# EAGLE design main-board (EAGLE 7.7.0)
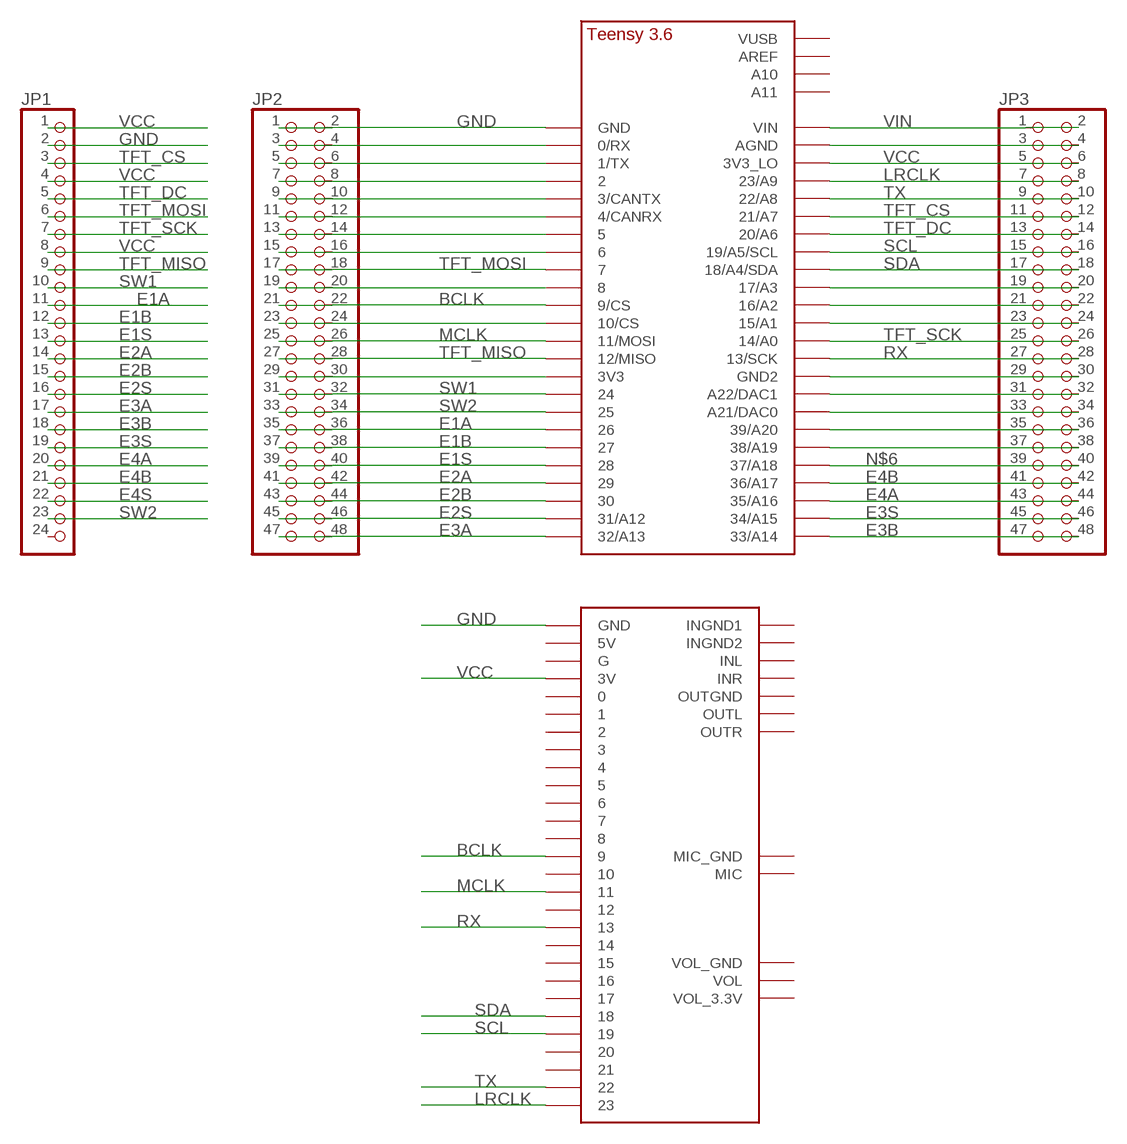
[diagram p0: schematic, sheet 1]

## Parts
JP1  PINHD-1X24  [1X24]
JP2  PINHD-2X24  [2X24]
JP3  PINHD-2X24  [2X24]
U$1  TEENSY_3.5/3.6_BASIC  [TEENSY_3.5/3.6_BASIC]
U$2  AUDIOSHIELD  [AUDIOSHIELD]

## Nets
BCLK: JP2.21 JP2.22 U$1.9/CS U$2.9
E1A: JP1.11 JP2.35 JP2.36 U$1.26
E1B: JP1.12 JP2.37 JP2.38 U$1.27
E1S: JP1.13 JP2.39 JP2.40 U$1.28
E2A: JP1.14 JP2.41 JP2.42 U$1.29
E2B: JP1.15 JP2.43 JP2.44 U$1.30
E2S: JP1.16 JP2.45 JP2.46 U$1.31/A12
E3A: JP1.17 JP2.47 JP2.48 U$1.32/A13
E3B: JP1.18 JP3.47 JP3.48 U$1.33/A14
E3S: JP1.19 JP3.45 JP3.46 U$1.34/A15
E4A: JP1.20 JP3.43 JP3.44 U$1.35/A16
E4B: JP1.21 JP3.41 JP3.42 U$1.36/A17
E4S: JP1.22
GND: JP1.2 JP2.1 JP2.2 U$1.GND U$2.GND
LRCLK: JP3.7 JP3.8 U$1.23/A9 U$2.23
MCLK: JP2.25 JP2.26 U$1.11/MOSI U$2.11
N$3: JP2.3 JP2.4 U$1.0/RX
N$4: JP2.5 JP2.6 U$1.1/TX
N$5: JP2.7 JP2.8 U$1.2
N$6: JP3.39 JP3.40 U$1.37/A18
N$7: JP2.9 JP2.10 U$1.3/CANTX
N$8: JP2.11 JP2.12 U$1.4/CANRX
N$9: JP2.13 JP2.14 U$1.5
N$10: JP2.15 JP2.16 U$1.6
N$11: JP2.19 JP2.20 U$1.8
N$12: JP2.23 JP2.24 U$1.10/CS
N$13: JP2.29 JP2.30 U$1.3V3
N$15: JP3.3 JP3.4 U$1.AGND
N$16: JP3.19 JP3.20 U$1.17/A3
N$17: JP3.21 JP3.22 U$1.16/A2
N$18: JP3.23 JP3.24 U$1.15/A1
N$19: JP3.29 JP3.30 U$1.GND2
N$20: JP3.31 JP3.32 U$1.A22/DAC1
N$21: JP3.33 JP3.34 U$1.21/DAC0(A21/DAC0)
N$22: JP3.35 JP3.36 U$1.39/A20
N$23: JP3.37 JP3.38 U$1.38/A19
RX: JP3.27 JP3.28 U$1.13/SCK U$2.13
SCL: JP3.15 JP3.16 U$1.19/A5/SCL U$2.19
SDA: JP3.17 JP3.18 U$1.18/A4/SDA U$2.18
SW1: JP1.10 JP2.31 JP2.32 U$1.24
SW2: JP1.23 JP2.33 JP2.34 U$1.25
TFT_CS: JP1.3 JP3.11 JP3.12 U$1.21/A7
TFT_DC: JP1.5 JP3.13 JP3.14 U$1.20/A6
TFT_MISO: JP1.9 JP2.27 JP2.28 U$1.12/MISO
TFT_MOSI: JP1.6 JP2.17 JP2.18 U$1.7
TFT_SCK: JP1.7 JP3.25 JP3.26 U$1.14/A0
TX: JP3.9 JP3.10 U$1.22/A8 U$2.22
VCC: JP1.1 JP1.4 JP1.8 JP3.5 JP3.6 U$1.3V3_LO U$2.3V
VIN: JP3.1 JP3.2 U$1.VIN
Unconnected: JP1.24 U$1.A10 U$1.A11 U$1.AREF U$1.VUSB U$2.0 U$2.1 U$2.2 U$2.3 U$2.4 U$2.5 U$2.5V U$2.6 U$2.7 U$2.8 U$2.10 U$2.12 U$2.14 U$2.15 U$2.16 U$2.17 U$2.20 U$2.21 U$2.G U$2.GND_MIC(MIC_GND) U$2.INGND1 U$2.INGND2 U$2.INL U$2.INR U$2.MIC U$2.OUTGND U$2.OUTL U$2.OUTR U$2.VOL U$2.VOL_3.3V U$2.VOL_GND

## Library data of the parts
JP1 = pinhead:PINHD-1X24: PIN HEADER
JP2 JP3 = pinhead:PINHD-2X24: PIN HEADER
U$1 = JC_Teensy356:TEENSY_3.5/3.6_BASIC
U$2 = Teensy_Audioshield:AUDIOSHIELD: Teensy 3 Audioshield by PJRC.COM

## Board
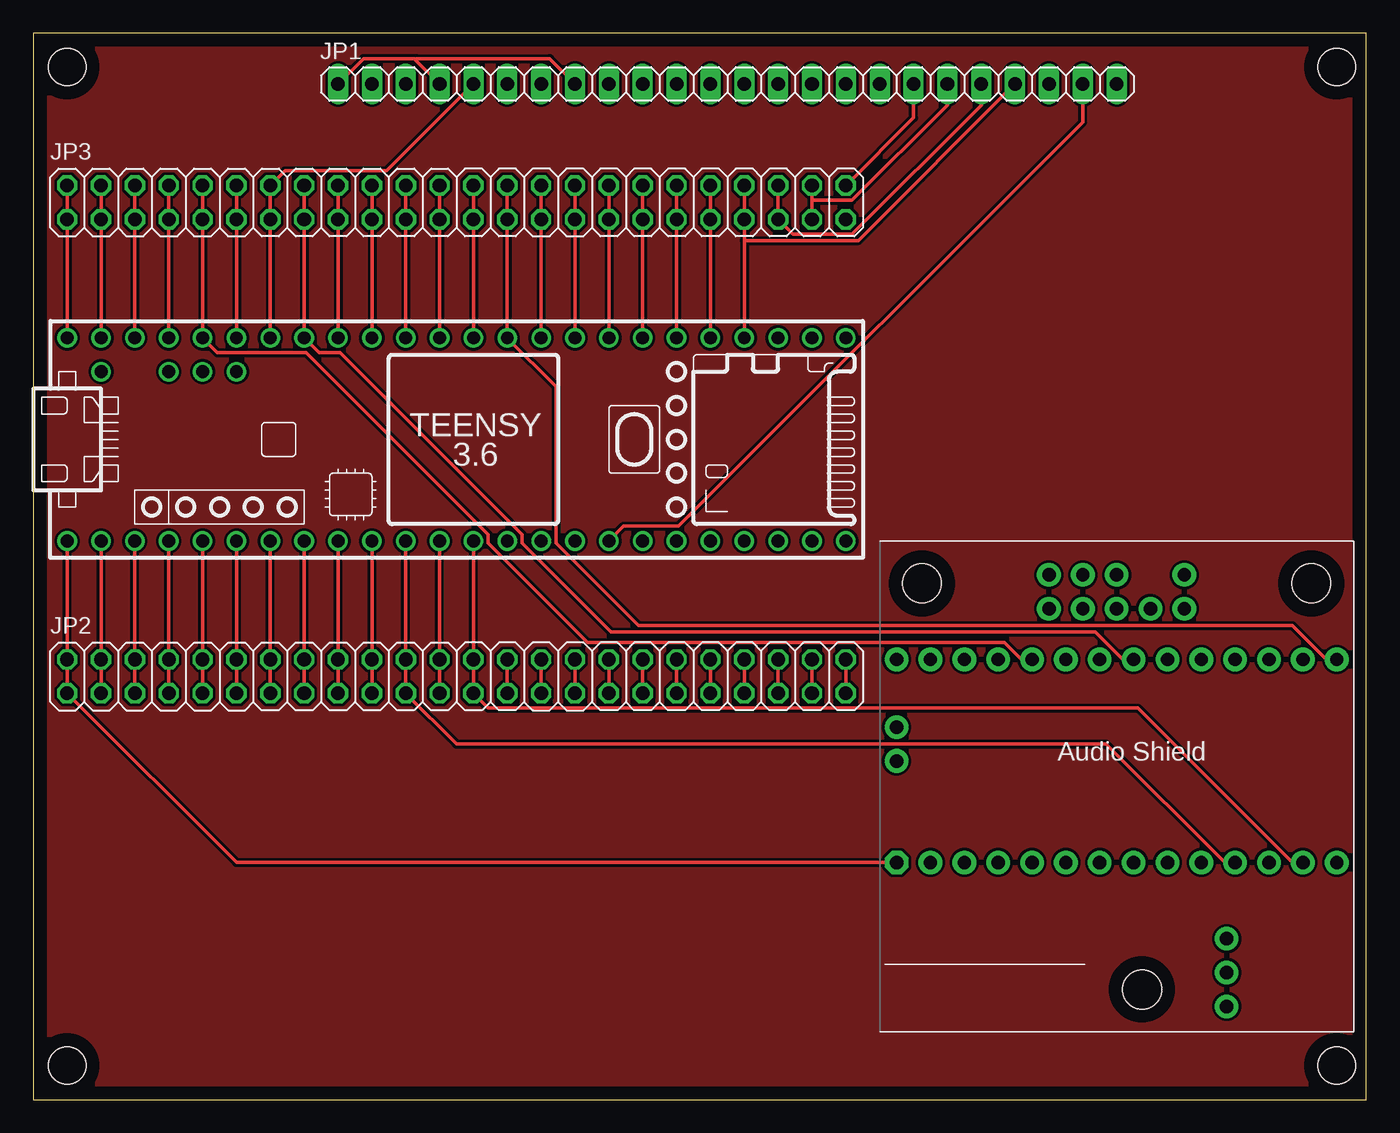
[diagram p1: board, top side]
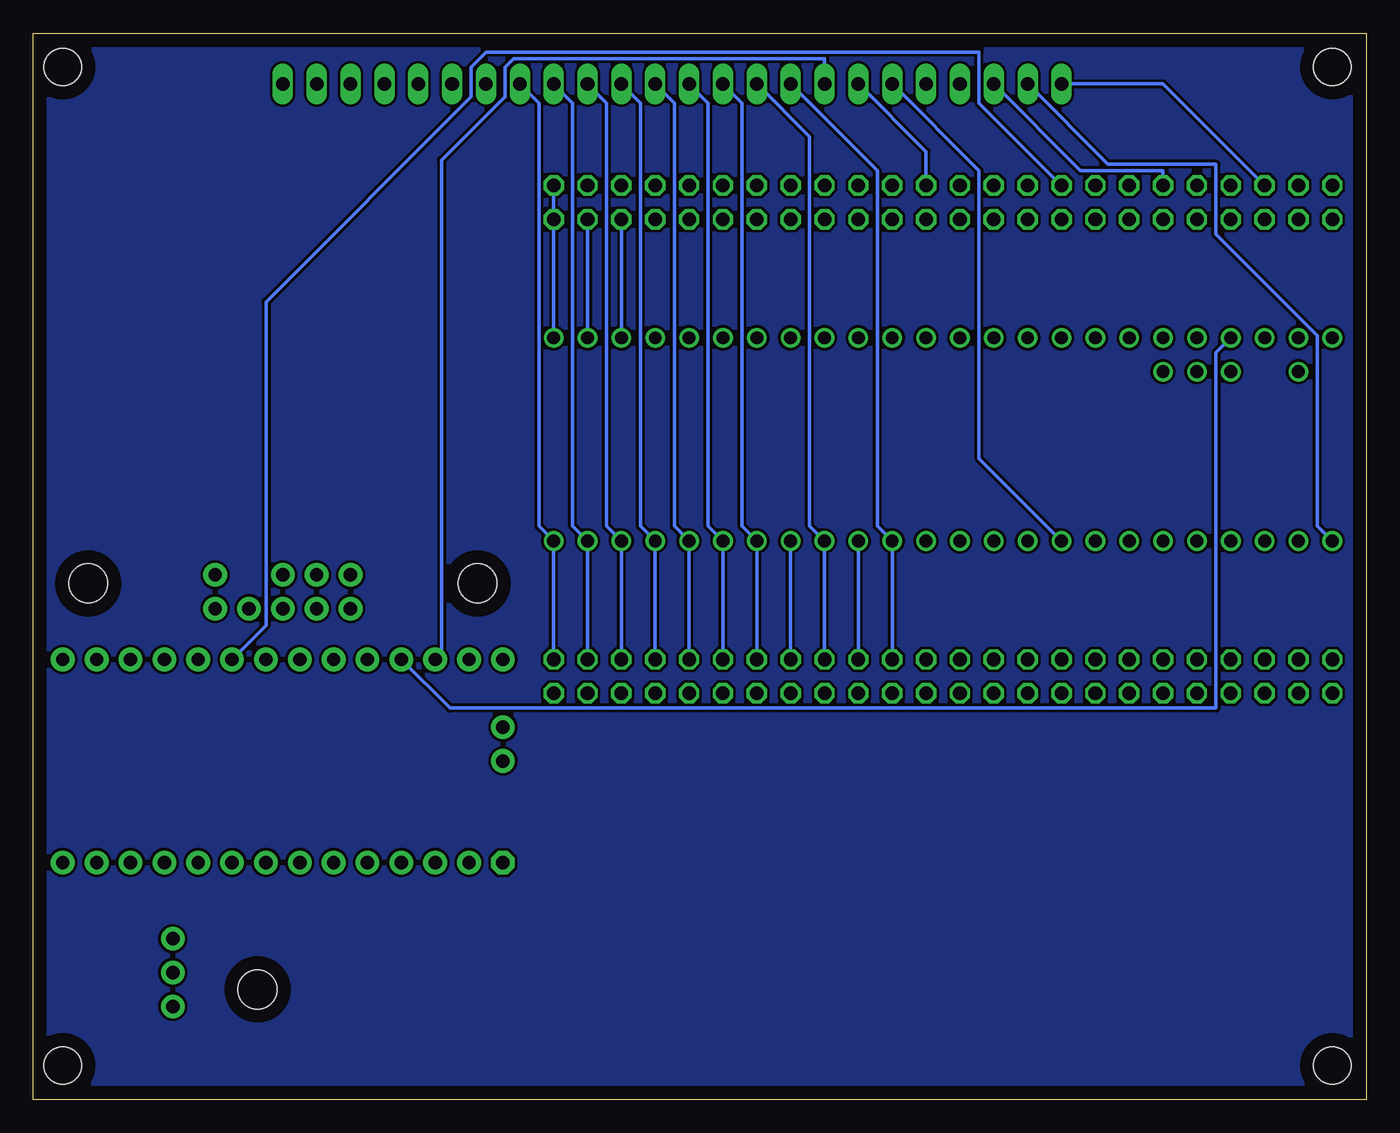
[diagram p2: board, bottom side, seen from below]

Size 100 x 80 mm. Coordinates in mm from the lower left corner, seen from the top.
Outline: 0,0 100,0 100,80 0,80 0,0
Copper layers (1*16): Top 0.035mm / dielectric 1.5mm / Bottom 0.035mm
Design rules "default": minimum track width 10mil, minimum drill 24mil, track to track 8mil, track to pad 8mil, pad to pad 8mil, via to via 8mil, smd to smd 8mil, copper to edge 40mil, drill to drill 8mil, minimum pad ring 10mil, minimum via ring 8mil, stop-mask expansion 4mil, vias tented up to drill 0mil, thermal gap 10mil
Holes 2.8 mm at 2.54,77.47 2.54,2.54 97.79,77.47 97.79,2.54

### Footprints (pad centres in the part's own frame; a part is rotated, then mirrored left to right if it is on the bottom)
1X24 = drill 1.016 long: 1 -29.21,0; 2 -26.67,0; 3 -24.13,0; 4 -21.59,0; 5 -19.05,0; 6 -16.51,0; 7 -13.97,0; 8 -11.43,0; 9 -8.89,0; 10 -6.35,0; 11 -3.81,0; 12 -1.27,0; 13 1.27,0; 14 3.81,0; 15 6.35,0; 16 8.89,0; 17 11.43,0; 18 13.97,0; 19 16.51,0; 20 19.05,0; 21 21.59,0; 22 24.13,0; 23 26.67,0; 24 29.21,0
2X24 = drill 1.016 octagon: 1 -27.94,-1.27; 2 -27.94,1.27; 3 -25.4,-1.27; 4 -25.4,1.27; 5 -22.86,-1.27; 6 -22.86,1.27; 7 -20.32,-1.27; 8 -20.32,1.27; 9 -17.78,-1.27; 10 -17.78,1.27; 11 -15.24,-1.27; 12 -15.24,1.27; 13 -12.7,-1.27; 14 -12.7,1.27; 15 -10.16,-1.27; 16 -10.16,1.27; 17 -7.62,-1.27; 18 -7.62,1.27; 19 -5.08,-1.27; 20 -5.08,1.27; 21 -2.54,-1.27; 22 -2.54,1.27; 23 0,-1.27; 24 0,1.27; 25 2.54,-1.27; 26 2.54,1.27; 27 5.08,-1.27; 28 5.08,1.27; 29 7.62,-1.27; 30 7.62,1.27; 31 10.16,-1.27; 32 10.16,1.27; 33 12.7,-1.27; 34 12.7,1.27; 35 15.24,-1.27; 36 15.24,1.27; 37 17.78,-1.27; 38 17.78,1.27; 39 20.32,-1.27; 40 20.32,1.27; 41 22.86,-1.27; 42 22.86,1.27; 43 25.4,-1.27; 44 25.4,1.27; 45 27.94,-1.27; 46 27.94,1.27; 47 30.48,-1.27; 48 30.48,1.27
TEENSY_3.5/3.6_BASIC = drill 0.965: 0/RX -25.4,-7.62; 1/TX -22.86,-7.62; 2 -20.32,-7.62; 3/CANTX -17.78,-7.62; 3V3 7.62,-7.62; 3V3_LO -22.86,7.62; 4/CANRX -15.24,-7.62; 5 -12.7,-7.62; 6 -10.16,-7.62; 7 -7.62,-7.62; 8 -5.08,-7.62; 9/CS -2.54,-7.62; 10/CS 0,-7.62; 11/MOSI 2.54,-7.62; 12/MISO 5.08,-7.62; 13/SCK 5.08,7.62; 14/A0 2.54,7.62; 15/A1 0,7.62; 16/A2 -2.54,7.62; 17/A3 -5.08,7.62; 18/A4/SDA -7.62,7.62; 19/A5/SCL -10.16,7.62; 20/A6 -12.7,7.62; 21/A7 -15.24,7.62; 21/DAC0 12.7,7.62; 22/A8 -17.78,7.62; 23/A9 -20.32,7.62; 24 10.16,-7.62; 25 12.7,-7.62; 26 15.24,-7.62; 27 17.78,-7.62; 28 20.32,-7.62; 29 22.86,-7.62; 30 25.4,-7.62; 31/A12 27.94,-7.62; 32/A13 30.48,-7.62; 33/A14 30.48,7.62; 34/A15 27.94,7.62; 35/A16 25.4,7.62; 36/A17 22.86,7.62; 37/A18 20.32,7.62; 38/A19 17.78,7.62; 39/A20 15.24,7.62; A10 -17.78,5.08; A11 -15.24,5.08; A22/DAC1 10.16,7.62; AGND -25.4,7.62; AREF -20.32,5.08; GND -27.94,-7.62; GND2 7.62,7.62; VIN -27.94,7.62; VUSB -25.4,5.08
AUDIOSHIELD = drill 1 pad 1.778: 0 -13.97,-5.08; 1 -11.43,-5.08; 2 -8.89,-5.08; 3 -6.35,-5.08; 3V -11.43,10.16; 4 -3.81,-5.08; 5 -1.27,-5.08; 5V -16.51,10.16; 6 1.27,-5.08; 7 3.81,-5.08; 8 6.35,-5.08; 9 8.89,-5.08; 10 11.43,-5.08; 11 13.97,-5.08; 12 16.51,-5.08; 13 16.51,10.16; 14 13.97,10.16; 15 11.43,10.16; 16 8.89,10.16; 17 6.35,10.16; 18 3.81,10.16; 19 1.27,10.16; 20 -1.27,10.16; 21 -3.81,10.16; 22 -6.35,10.16; 23 -8.89,10.16; G -13.97,10.16; GND_MIC -16.51,2.54; INGND1 -5.08,16.51; INGND2 -2.54,16.51; INL -5.08,13.97; INR -2.54,13.97; MIC -16.51,5.08; OUTGND 2.54,13.97; OUTL 5.08,13.97; OUTR 0,13.97; UNUSED1 0,16.51; UNUSED2 5.08,16.51; VOL 8.255,-13.335; VOL_3.3V 8.255,-15.875; VOL_GND 8.255,-10.795 | drill 1 pad 1.778 octagon: GND -16.51,-5.08 | hole 2.921: 1.905,-14.605; -14.605,15.875; 14.605,15.875

### Placement (x,y rotation side)
JP1  52.07,76.2 0 top
JP2  30.48,31.75 0 top
JP3  30.48,67.31 0 top
U$1  30.48,49.53 0 top
U$2  81.28,22.86 0 top

### Tracks (layer width: path | path; a pad name or v marks a point on that pad's centre or on a via)
BCLK
  Top 0.254: U$1.9/CS JP2.22 JP2.21 31.75,26.67 80.49,26.67 89.38,17.78 U$2.9
E1A
  Top 0.254: JP2.36 JP2.35
  Bottom 0.254: JP2.36 U$1.26 46.83,43.02 46.83,74.77 JP1.11
E1B
  Top 0.254: JP2.38 JP2.37
  Bottom 0.254: JP2.38 U$1.27 49.37,43.02 49.37,74.77 JP1.12
E1S
  Top 0.254: JP2.40 JP2.39
  Bottom 0.254: JP2.40 U$1.28 51.91,43.02 51.91,74.77 JP1.13
E2A
  Top 0.254: JP2.42 JP2.41
  Bottom 0.254: JP2.42 U$1.29 54.45,43.02 54.45,74.77 JP1.14
E2B
  Top 0.254: JP2.44 JP2.43
  Bottom 0.254: JP2.44 U$1.30 56.99,43.02 56.99,74.77 JP1.15
E2S
  Top 0.254: JP2.46 JP2.45
  Bottom 0.254: JP2.46 U$1.31/A12 59.53,43.02 59.53,74.77 JP1.16
E3A
  Top 0.254: JP2.48 JP2.47
  Bottom 0.254: JP2.48 U$1.32/A13 62.07,43.02 62.07,74.77 JP1.17
E3B
  Top 0.254: JP1.18 66.04,73.66 JP3.48
  Bottom 0.254: U$1.33/A14 JP3.47 JP3.48
E3S
  Top 0.254: JP3.45 58.42,67.47 | 58.42,67.47 JP3.46 | JP1.19 68.58,74.61 61.44,67.47 58.42,67.47
  Bottom 0.254: JP3.45 U$1.34/A15
E4A
  Top 0.254: JP3.44 JP3.43 56.99,64.93 61.44,64.93 71.12,74.61 JP1.20
  Bottom 0.254: JP3.43 U$1.35/A16
E4B
  Top 0.254: 53.34,64.45 JP3.41 JP3.42 | 53.34,64.45 U$1.36/A17 | JP1.21 61.91,64.45 53.34,64.45
GND
  Top 0.254: U$1.GND JP2.2 JP2.1 15.24,17.78 U$2.GND
  Bottom 0.254: JP1.2 19.37,70.17 11.27,70.17 11.27,64.93 3.65,57.31 3.65,43.02 U$1.GND
LRCLK
  Top 0.254: U$1.23/A9 JP3.7 JP3.8
  Bottom 0.254: U$2.23 68.74,29.37 11.27,29.37 11.27,56.04 U$1.23/A9
MCLK
  Top 0.254: U$1.11/MOSI JP2.26 JP2.25 34.13,29.37 82.87,29.37 94.46,17.78 U$2.11
N$1
  pour Top: 0,0 0,77.47 0,78.74 1.27,80.01 99.06,80.01 100.33,78.74 100.33,2.54 97.79,0
N$2
  pour Bottom: 0,76.2 0,77.47 2.54,80.01 97.79,80.01 100.33,77.47 100.33,1.27 99.06,0 2.54,0 0,2.54
N$3
  Top 0.254: U$1.0/RX JP2.4 JP2.3
N$4
  Top 0.254: U$1.1/TX JP2.6 JP2.5
N$5
  Top 0.254: U$1.2 JP2.8 JP2.7
N$6
  Top 0.254: U$1.37/A18 JP3.39 JP3.40
N$7
  Top 0.254: U$1.3/CANTX JP2.10 JP2.9
N$8
  Top 0.254: U$1.4/CANRX JP2.12 JP2.11
N$9
  Top 0.254: U$1.5 JP2.14 JP2.13
N$10
  Top 0.254: U$1.6 JP2.16 JP2.15
N$11
  Top 0.254: U$1.8 JP2.20 JP2.19
N$12
  Top 0.254: U$1.10/CS JP2.24 JP2.23
N$13
  Top 0.254: JP2.30 JP2.29
  Bottom 0.254: JP2.30 U$1.3V3
N$15
  Top 0.254: U$1.AGND JP3.3 JP3.4
N$16
  Top 0.254: U$1.17/A3 JP3.19 JP3.20
N$17
  Top 0.254: U$1.16/A2 JP3.21 JP3.22
N$18
  Top 0.254: U$1.15/A1 JP3.23 JP3.24
N$19
  Top 0.254: U$1.GND2 JP3.29 JP3.30
N$20
  Top 0.254: U$1.A22/DAC1 JP3.31 JP3.32
N$21
  Top 0.254: U$1.21/DAC0 JP3.33 JP3.34
N$22
  Top 0.254: U$1.39/A20 JP3.35 JP3.36
N$23
  Top 0.254: U$1.38/A19 JP3.37 JP3.38
RX
  Top 0.254: JP3.28 JP3.27 U$1.13/SCK 39.21,53.5 39.21,41.75 45.4,35.56 94.46,35.56 97,33.02 U$2.13
SCL
  Top 0.254: JP3.16 JP3.15 U$1.19/A5/SCL 21.43,56.04 23.02,56.04 36.67,42.39 36.67,41.75 43.34,35.08 79.69,35.08 81.76,33.02 U$2.19
SDA
  Top 0.254: U$1.18/A4/SDA JP3.17 JP3.18
  Bottom 0.254: U$2.18 82.55,35.56 82.55,59.85 67.15,75.25 67.15,77.47 66.04,78.58 29.05,78.58 29.05,74.77 JP3.18
SW1
  Top 0.254: JP2.32 JP2.31
  Bottom 0.254: JP2.32 U$1.24 41.75,43.02 41.75,72.23 JP1.10
SW2
  Top 0.254: JP2.34 JP2.33 | JP1.23 78.74,73.34 48.42,43.02 44.29,43.02 U$1.25
  Bottom 0.254: JP2.34 U$1.25
TFT_CS
  Top 0.254: U$1.21/A7 JP3.11 JP3.12
  Bottom 0.254: JP1.3 21.43,69.69 15.24,69.69 JP3.12
TFT_DC
  Top 0.254: U$1.20/A6 JP3.13 JP3.14 18.89,69.69 26.51,69.69 JP1.5
TFT_MISO
  Top 0.254: JP2.28 JP2.27
  Bottom 0.254: JP2.28 U$1.12/MISO 36.67,43.02 36.67,69.69 JP1.9
TFT_MOSI
  Top 0.254: U$1.7 JP2.18 JP2.17
  Bottom 0.254: JP1.6 29.05,69.69 29.05,48.1 U$1.7
TFT_SCK
  Top 0.254: U$1.14/A0 JP3.25 JP3.26
  Bottom 0.254: JP1.7 33.02,71.12 JP3.26
TX
  Top 0.254: JP3.10 JP3.9 U$1.22/A8 13.81,56.04 20.48,56.04 34.13,42.39 34.13,41.75 41.59,34.29 72.87,34.29 74.14,33.02 U$2.22
VCC
  Top 0.254: U$1.3V3_LO JP3.5 JP3.6 | JP1.1 24.77,78.11 28.57,78.11 28.65,78.03 | JP1.4 28.65,78.03 | JP1.8 38.73,78.11 28.73,78.11 28.65,78.03
  Bottom 0.254: U$2.3V 69.37,33.5 69.37,70.48 64.61,75.25 64.61,77.47 63.98,78.11 40.64,78.11 JP1.8 | JP3.6 15.24,76.2 JP1.1
VIN
  Top 0.254: U$1.VIN JP3.1 JP3.2